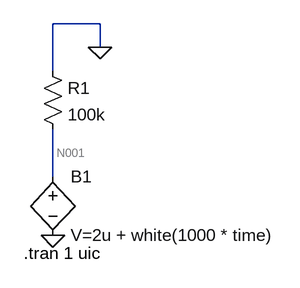
[diagram p0: schematic Draft3.asc]
Draft3.asc, the LTspice schematic file:
Version 4.1
SHEET 1 880 680
WIRE 272 -208 208 -208
WIRE 272 -176 272 -208
WIRE 208 -144 208 -208
WIRE 208 0 208 -64
FLAG 208 80 0
FLAG 272 -176 0
SYMBOL bv 208 -16 R0
SYMATTR InstName B1
SYMATTR Value V=2u + white(1000 * time)
SYMBOL res 192 -160 R0
SYMATTR InstName R1
SYMATTR Value 100k
TEXT 168 104 Left 2 !.tran 1 uic

The netlist it stands for:
* Draft3.asc
B1 N001 0 V=2u + white(1000 * time)
R1 0 N001 100k
.tran 1 uic
.backanno
.end

* Results of the author's LTspice run, read from the files saved beside the schematic
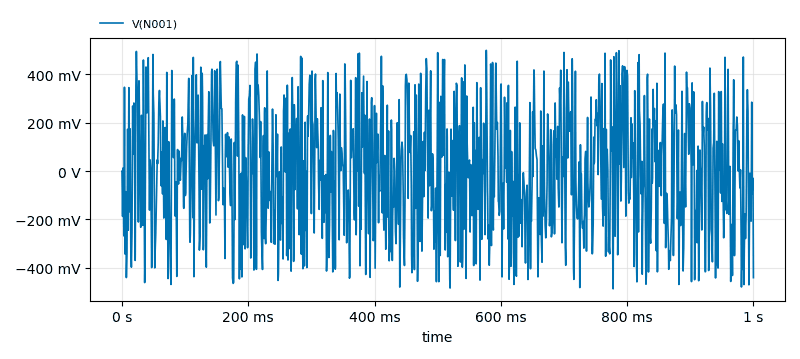
[diagram p1: Transient Analysis of Draft3.asc, plotted from the saved traces]
* Transient Analysis, 1 run:
*   V(N001): min -485.8 mV, max 497.5 mV, average 94.62 µV, rms 242.3 mV, last -439.9 mV